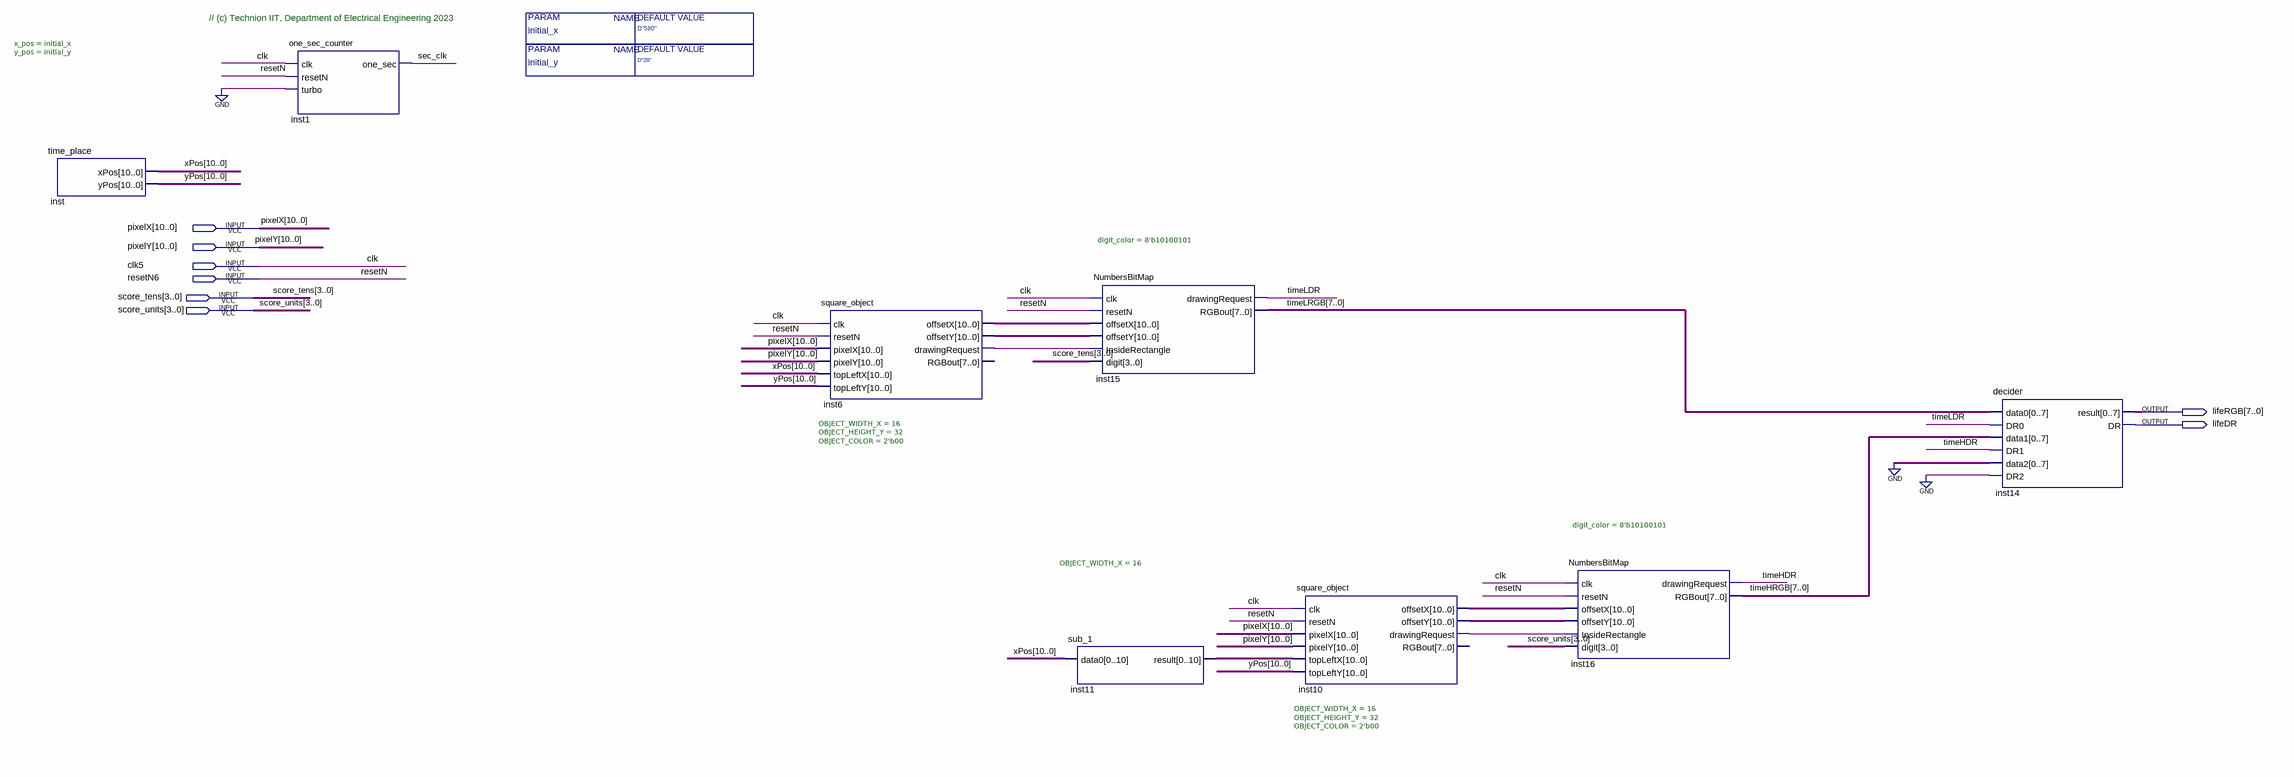
[diagram p0: schematic sheet]
// Quartus schematic life_Block_T.bdf as structural Verilog: 8 symbols, 8 pins
module life_Block_T #(parameter initial_x = "D\"580\"", parameter initial_y = "D\"28\"") (
  input  [10:0] pixelX,
  input  [10:0] pixelY,
  input  clk5,
  input  resetN6,
  input  [3:0] score_tens,
  input  [3:0] score_units,
  output [7:0] lifeRGB,
  output lifeDR
);

  wire inst6_drawingrequest, inst10_drawingrequest, sec_clk, timeHDR, timeLDR;
  wire [7:0] timeHRGB, timeLRGB;
  wire [10:0] inst6_offsetx, inst6_offsety, inst10_offsetx, inst10_offsety, inst11_result, xPos, yPos;

  time_place #(.x_pos(initial_x), .y_pos(initial_y)) inst (.xPos(xPos), .yPos(yPos));
  one_sec_counter inst1 (.clk(clk5), .resetN(resetN6), .turbo(1'b0), .one_sec(sec_clk));
  square_object #(.OBJECT_WIDTH_X(16), .OBJECT_HEIGHT_Y(32), .OBJECT_COLOR(2'b00)) inst6 (
    .clk(clk5), .resetN(resetN6), .pixelX(pixelX), .pixelY(pixelY), .topLeftX(xPos), .topLeftY(yPos),
    .offsetX(inst6_offsetx), .offsetY(inst6_offsety), .drawingRequest(inst6_drawingrequest));  // open: RGBout
  sub_1 #(.OBJECT_WIDTH_X(16)) inst11 (.data0(xPos), .result(inst11_result));
  NumbersBitMap #(.digit_color(8'b10100101)) inst15 (
    .clk(clk5), .resetN(resetN6), .offsetX(inst6_offsetx), .offsetY(inst6_offsety),
    .InsideRectangle(inst6_drawingrequest), .digit(score_tens), .drawingRequest(timeLDR), .RGBout(timeLRGB));
  square_object #(.OBJECT_WIDTH_X(16), .OBJECT_HEIGHT_Y(32), .OBJECT_COLOR(2'b00)) inst10 (
    .clk(clk5), .resetN(resetN6), .pixelX(pixelX), .pixelY(pixelY), .topLeftX(inst11_result),
    .topLeftY(yPos), .offsetX(inst10_offsetx), .offsetY(inst10_offsety),
    .drawingRequest(inst10_drawingrequest));  // open: RGBout
  NumbersBitMap #(.digit_color(8'b10100101)) inst16 (
    .clk(clk5), .resetN(resetN6), .offsetX(inst10_offsetx), .offsetY(inst10_offsety),
    .InsideRectangle(inst10_drawingrequest), .digit(score_units), .drawingRequest(timeHDR), .RGBout(timeHRGB));
  decider inst14 (
    .data0(timeLRGB), .DR0(timeLDR), .data1(timeHRGB), .DR1(timeHDR), .data2({8{1'b0}}), .DR2(1'b0),
    .result(lifeRGB), .DR(lifeDR));

  // Other names for the same wires on the sheet: clk = clk5; resetN = resetN6

  // Notes on the sheet:
  //   // (c) Technion IIT, Department of Electrical Engineering 2023
endmodule
